# Altium project STM32F103C8T6最小系统板.PrjPcb
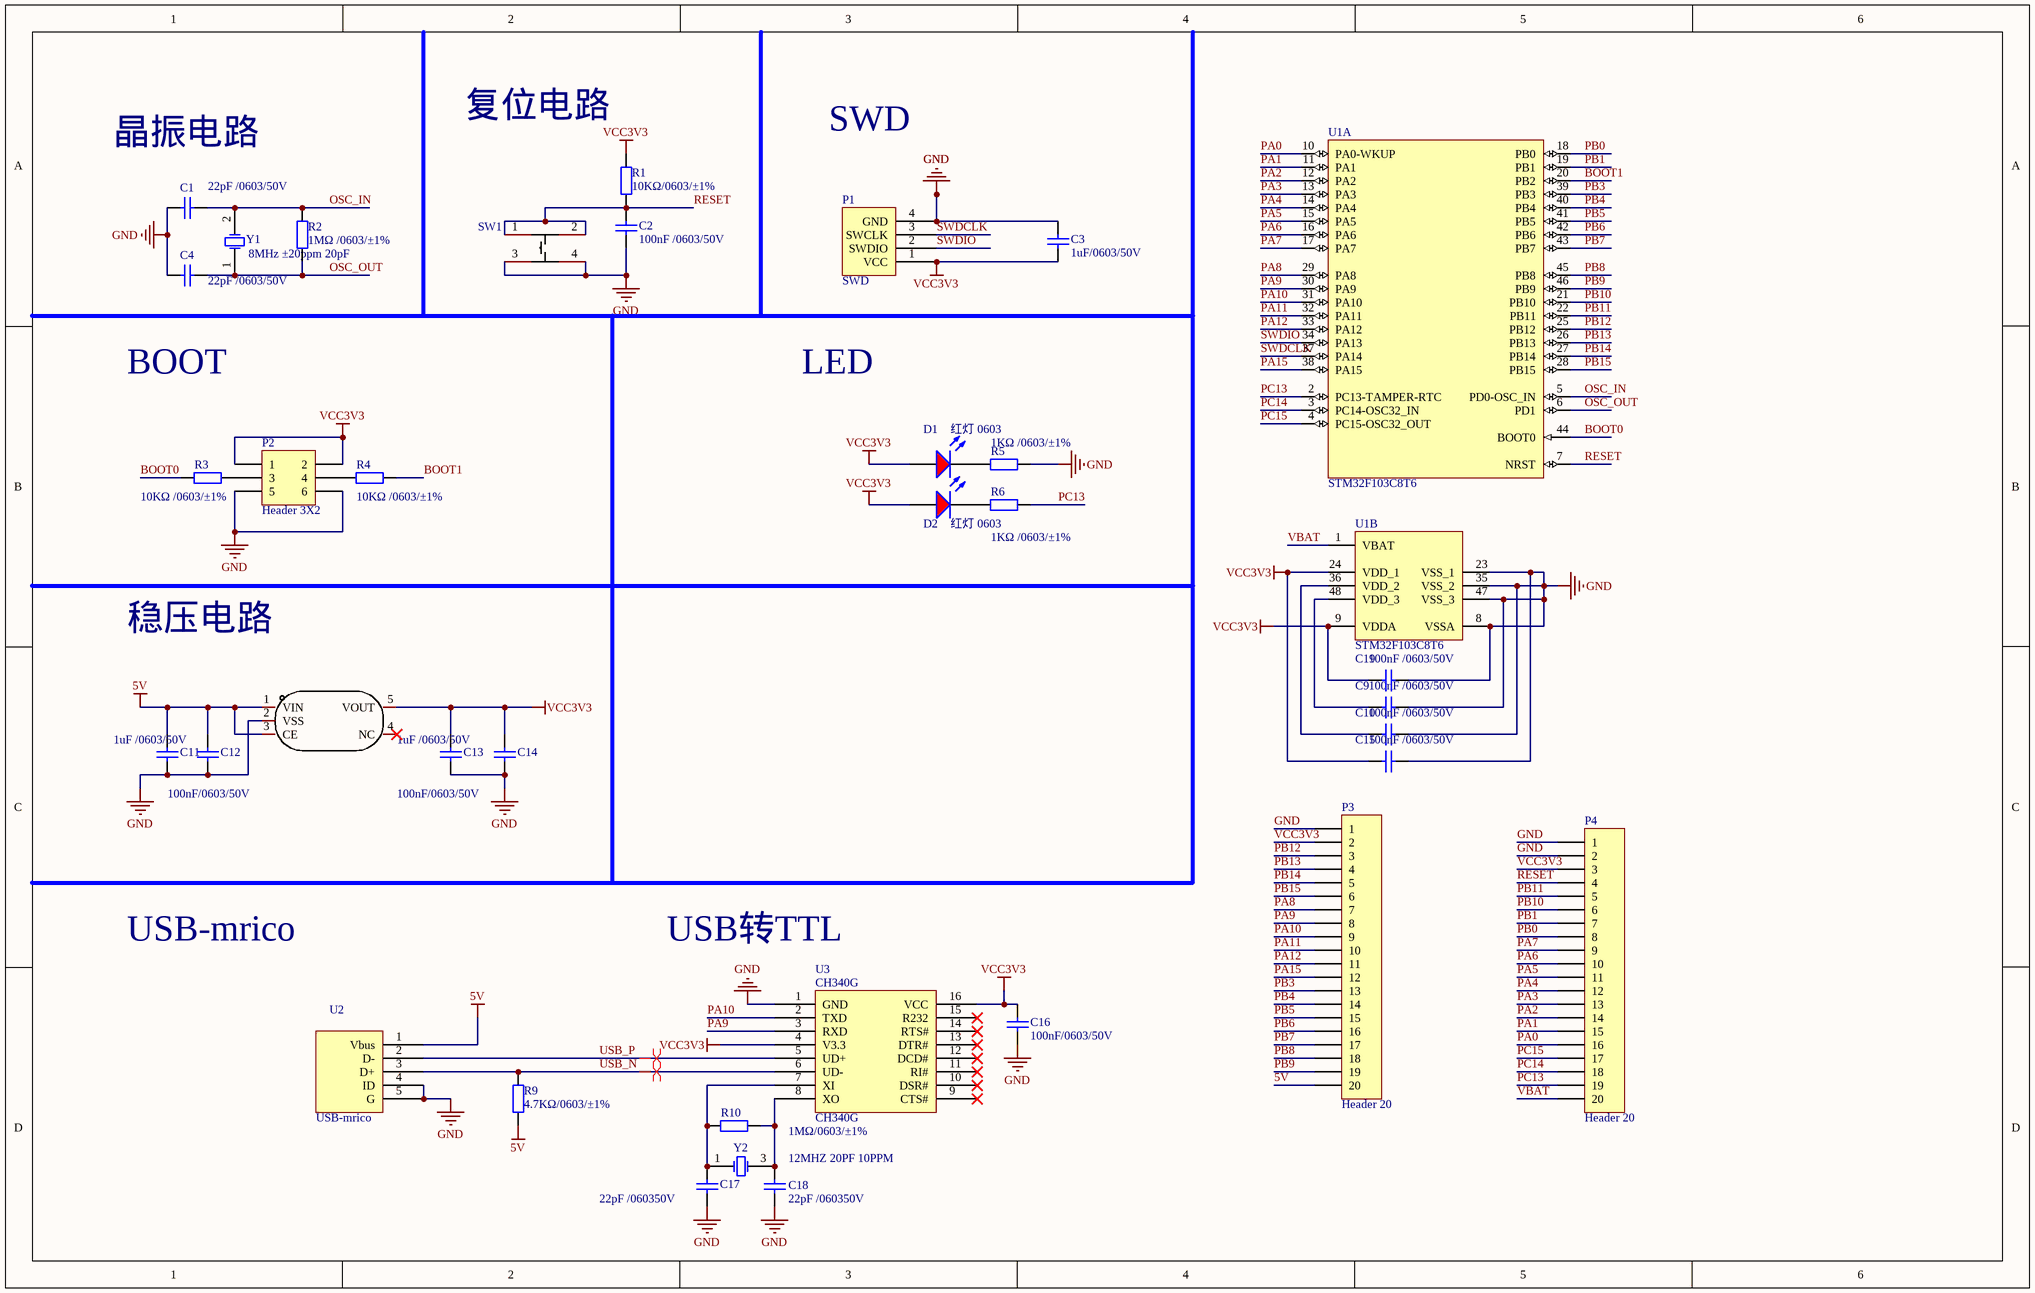
[diagram p0: C8T6.SchDoc]
1 sheet, 36 parts. Net scope: global (net labels, ports and power ports of the same name join across sheets).
Board file: C8T6.PcbDoc

## Sheet C8T6.SchDoc
size B

### Parts
C1  22pF /0603/50V  [0603_C]
C2  100nF /0603/50V  [0603_C]
C3  1uF/0603/50V  [0603_C]
C4  22pF /0603/50V  [0603_C]
C9  100nF /0603/50V  [0603_C]
C10  100nF /0603/50V  [0603_C]
C11  1uF /0603/50V  [0603_C]
C12  100nF/0603/50V  [0603_C]
C13  1uF /0603/50V  [0603_C]
C14  100nF/0603/50V  [0603_C]
C15  100nF /0603/50V  [0603_C]
C16  100nF/0603/50V  [0603_C]
C17  22pF /060350V  [0603_C]
C18  22pF /060350V  [0603_C]
C19  100nF /0603/50V  [0603_C]
D1  红灯 0603  [0603_LED_S1]
D2  红灯 0603  [0603_LED_S1]
LDO1  ME6211C33M5G-N  [SOT-23-5_L3.0-W1.7-P0.95-LS2.8-BL]  (value not drawn)
P1  SWD  [HDR4x1]
P2  Header 3X2  [HDR2X3]
P3  Header 20  [HDR1X20]
P4  Header 20  [HDR1X20]
R1  10KΩ/0603/±1%  [0603_R]
R2  1MΩ /0603/±1%  [0603_R]
R3  10KΩ /0603/±1%  [0603_R]
R4  10KΩ /0603/±1%  [0603_R]
R5  1KΩ /0603/±1%  [0603_R]
R6  1KΩ /0603/±1%  [0603_R]
R9  4.7KΩ/0603/±1%  [0603_R]
R10  1MΩ/0603/±1%  [0603_R]
SW1  KEY_SMD_4P  [SW-SMD_4P-L4.2-W3.3-P2.15-LS5.1 - duplicate]  (value not drawn)
U1  STM32F103C8T6  [LQFP-48_7x7x05P]  (parts A,B of 2)
U2  USB-mrico  [Micro_USB]
U3  CH340G  [SOIC-16_150mil]
Y1  8MHz ±20ppm 20pF  [SMD-5032_2P]
Y2  12MHZ 20PF 10PPM  [SMD-3225_4P]

### Nets
5V: C11.2 C12.2 LDO1.1(VIN) LDO1.3(CE) P3.20 R9.1 U2.1(Vbus)
GND: C1.1 C2.1 C3.2 C4.1 C9.2 C10.2 C11.1 C12.1 C13.1 C14.1 C15.2 C16.2 C17.2 C18.2 C19.2 LDO1.2(VSS) P1.4(GND) P2.5 P2.6 P3.1 P4.1 P4.2 R5.2 SW1.3 SW1.4 U1.8(VSSA) U1.23(VSS_1) U1.35(VSS_2) U1.47(VSS_3) U2.4(ID) U2.5(G) U3.1(GND)
VCC3V3: C3.1 C13.2 C14.2 C15.1 C16.1 C19.1 D1.A D2.A LDO1.5(VOUT) P1.1(VCC) P2.1 P2.2 P3.2 P4.3 R1.2 U1.9(VDDA) U1.24(VDD_1) U3.4(V3.3) U3.16(VCC)
BOOT0: R3.1 U1.44(BOOT0)
BOOT1: R4.2 U1.20(PB2)
OSC_IN: C1.2 R2.2 U1.5(PD0-OSC_IN) Y1.2(OSC2)
OSC_OUT: C4.2 R2.1 U1.6(PD1) Y1.1(OSC1)
PA0: P4.16 U1.10(PA0-WKUP)
PA1: P4.15 U1.11(PA1)
PA2: P4.14 U1.12(PA2)
PA3: P4.13 U1.13(PA3)
PA4: P4.12 U1.14(PA4)
PA5: P4.11 U1.15(PA5)
PA6: P4.10 U1.16(PA6)
PA7: P4.9 U1.17(PA7)
PA8: P3.7 U1.29(PA8)
PA9: P3.8 U1.30(PA9) U3.3(RXD)
PA10: P3.9 U1.31(PA10) U3.2(TXD)
PA11: P3.10 U1.32(PA11)
PA12: P3.11 U1.33(PA12)
PA15: P3.12 U1.38(PA15)
PB0: P4.8 U1.18(PB0)
PB1: P4.7 U1.19(PB1)
PB3: P3.13 U1.39(PB3)
PB4: P3.14 U1.40(PB4)
PB5: P3.15 U1.41(PB5)
PB6: P3.16 U1.42(PB6)
PB7: P3.17 U1.43(PB7)
PB8: P3.18 U1.45(PB8)
PB9: P3.19 U1.46(PB9)
PB10: P4.6 U1.21(PB10)
PB11: P4.5 U1.22(PB11)
PB12: P3.3 U1.25(PB12)
PB13: P3.4 U1.26(PB13)
PB14: P3.5 U1.27(PB14)
PB15: P3.6 U1.28(PB15)
PC13: P4.19 R6.2 U1.2(PC13-TAMPER-RTC)
PC14: P4.18 U1.3(PC14-OSC32_IN)
PC15: P4.17 U1.4(PC15-OSC32_OUT)
RESET: C2.2 P4.4 R1.1 SW1.1 SW1.2 U1.7(NRST)
SWDCLK: P1.3(SWCLK) U1.37(PA14)
SWDIO: P1.2(SWDIO) U1.34(PA13)
USB_N: R9.2 U2.3(D+) U3.6(UD-)
USB_P: U2.2(D-) U3.5(UD+)
VBAT: P4.20 U1.1(VBAT)
NetC9_1: C9.1 U1.48(VDD_3)
NetC10_1: C10.1 U1.36(VDD_2)
NetC17_1: C17.1 R10.1 U3.7(XI) Y2.1(OSC1)
NetC18_1: C18.1 R10.2 U3.8(XO) Y2.3(OSC2)
NetD1_K: D1.K R5.1
NetD2_K: D2.K R6.1
NetP2_3: P2.3 R3.2
NetP2_4: P2.4 R4.1

Not connected (* = marked no-connect by the designer): LDO1 4(NC)*; U3 9(CTS#)* 10(DSR#)* 11(RI#)* 12(DCD#)* 13(DTR#)* 14(RTS#)* 15(R232)*

### Layout directives
differential pair: USB_N, USB_P

### Notes on the sheet
- 晶振电路
- 复位电路
- SWD
- BOOT
- LED
- 稳压电路
- USB-mrico
- USB转TTL

### Library data of the parts
C1 C4 C17 C18 = 0603 22pF (220) 5% 50V: 贴片电容; ComponentLink1Description: 供应商链接; ComponentLink1URL: http://www.szlcsc.com/product/details_2005.html; Package: 0603; Supplier: LC; SuppliersPartNumber: C1653
C2 C9 C10 C12 C14-C16 C19 = 0603 100nF (104) 10% 50V: 贴片电容; ComponentLink1Description: 供应商链接; ComponentLink1URL: http://www.szlcsc.com/product/details_15331.html; Package: 0603; Supplier: LC; SuppliersPartNumber: C14663
C3 C11 C13 = 0603 1uF (105) 10% 50V: 贴片电容; ComponentLink1Description: 供应商链接; ComponentLink1URL: http://www.szlcsc.com/product/details_16531.html; Package: 0603; Supplier: LC; SuppliersPartNumber: C15849
D1 D2 = 0603 红灯: 发光二极管; ComponentLink1Description: 供应商链接; ComponentLink1URL: http://www.szlcsc.com/product/details_2659.html; Package: 0603; Supplier: LC; SuppliersPartNumber: C2286
LDO1 = ME6211C33M5G-N: Manufacturer: MICRONE(南京微盟); Add into BOM: yes; Voltage - Input (Max): 6V; Current - Supply (Max): 60μA; Voltage Dropout (Max): 260mV @ 200mA(typ); Output Current (Max): 500mA; Output Configuration: 正; Ripple Rejection (PSRR): 70dB ~ 62dB(1kHz ~ 10kHz); Output Type: 固定; Number of Output Channels: 1; Voltage - Output (Fixed): 3.3V; Name: ME6211C33M5G-N; Symbol: ME6211C33M5G-N; Device: ME6211C33M5G-N; LCSC Part Name: ME6211C33M5G-N; Supplier Part: C82942; Manufacturer Part: ME6211C33M5G-N; Supplier Footprint: SOT-23-5; JLCPCB Part Class: Extended Part; Datasheet: https://atta.szlcsc.com/upload/public/pdf/source/20170918/C82942_1505727073070976520.pdf; Supplier: LCSC; Convert to PCB: yes; Voltage - Output (adj): -; Quiescent Current (Iq): -; Operating Temperature: -40℃~150℃; Enabling feet: -
P2 = Header 3X2: Header, 3-Pin, Dual row; LatestRevisionDate: 17-Jul-2002; LatestRevisionNote: Re-released for DXP Platform.; Publisher: Altium Limited
P3 P4 = Header 20: Header, 20-Pin; LatestRevisionDate: 17-Jul-2002; LatestRevisionNote: Re-released for DXP Platform.; Publisher: Altium Limited
R1 R3-R6 = 0603 10KΩ (1002) 1%_1: 贴片电阻; ComponentLink1Description: 供应商链接; ComponentLink1URL: http://www.szlcsc.com/product/details_26547.html; Package: 0603; Supplier: LC; SuppliersPartNumber: C25804
R2 R10 = 0603 1MΩ (1004) 1%: 贴片电阻; ComponentLink1Description: 供应商链接; ComponentLink1URL: http://www.szlcsc.com/product/details_23662.html; Package: 0603; Supplier: LC; SuppliersPartNumber: C22935
R9 = 0603 4.7KΩ (4701) 1%: 贴片电阻; ComponentLink1Description: 供应商链接; ComponentLink1URL: http://www.szlcsc.com/product/details_23889.html; Package: 0603; Supplier: LC; SuppliersPartNumber: C23162
U1 = STM32F103C8T6: ARM; ComponentLink1Description: 供应商链接; ComponentLink1URL: http://www.szlcsc.com/product/details_9243.html; Package: LQFP-48_7x7x05P; Supplier: LC; SuppliersPartNumber: C8734
U2 = usb-STM
U3 = CH340G_[C14267]: USB; ComponentLink1Description: 供应商链接; ComponentLink1URL: http://www.szlcsc.com/product/details_14927.html; Package: SOIC-16_150mil; Supplier: LC; SuppliersPartNumber: C14267
Y1 = SMD-5032_2P 8MHz 20ppm 20pF: 贴片晶振; ComponentLink1Description: 供应商链接; ComponentLink1URL: http://www.szlcsc.com/product/details_117214.html; Package: SMD-5032_2P; Supplier: LC; SuppliersPartNumber: C115962
Y2 = SMD-3225_4P  12MHZ 20PF 10PPM: 贴片晶振; ComponentLink1Description: 供应商链接; ComponentLink1URL: http://www.szlcsc.com/product/details_9522.html; Package: SMD-3225_4P; Supplier: LC; SuppliersPartNumber: C9002